# EAGLE design CS_NAV_SNS (EAGLE 9.4.2)
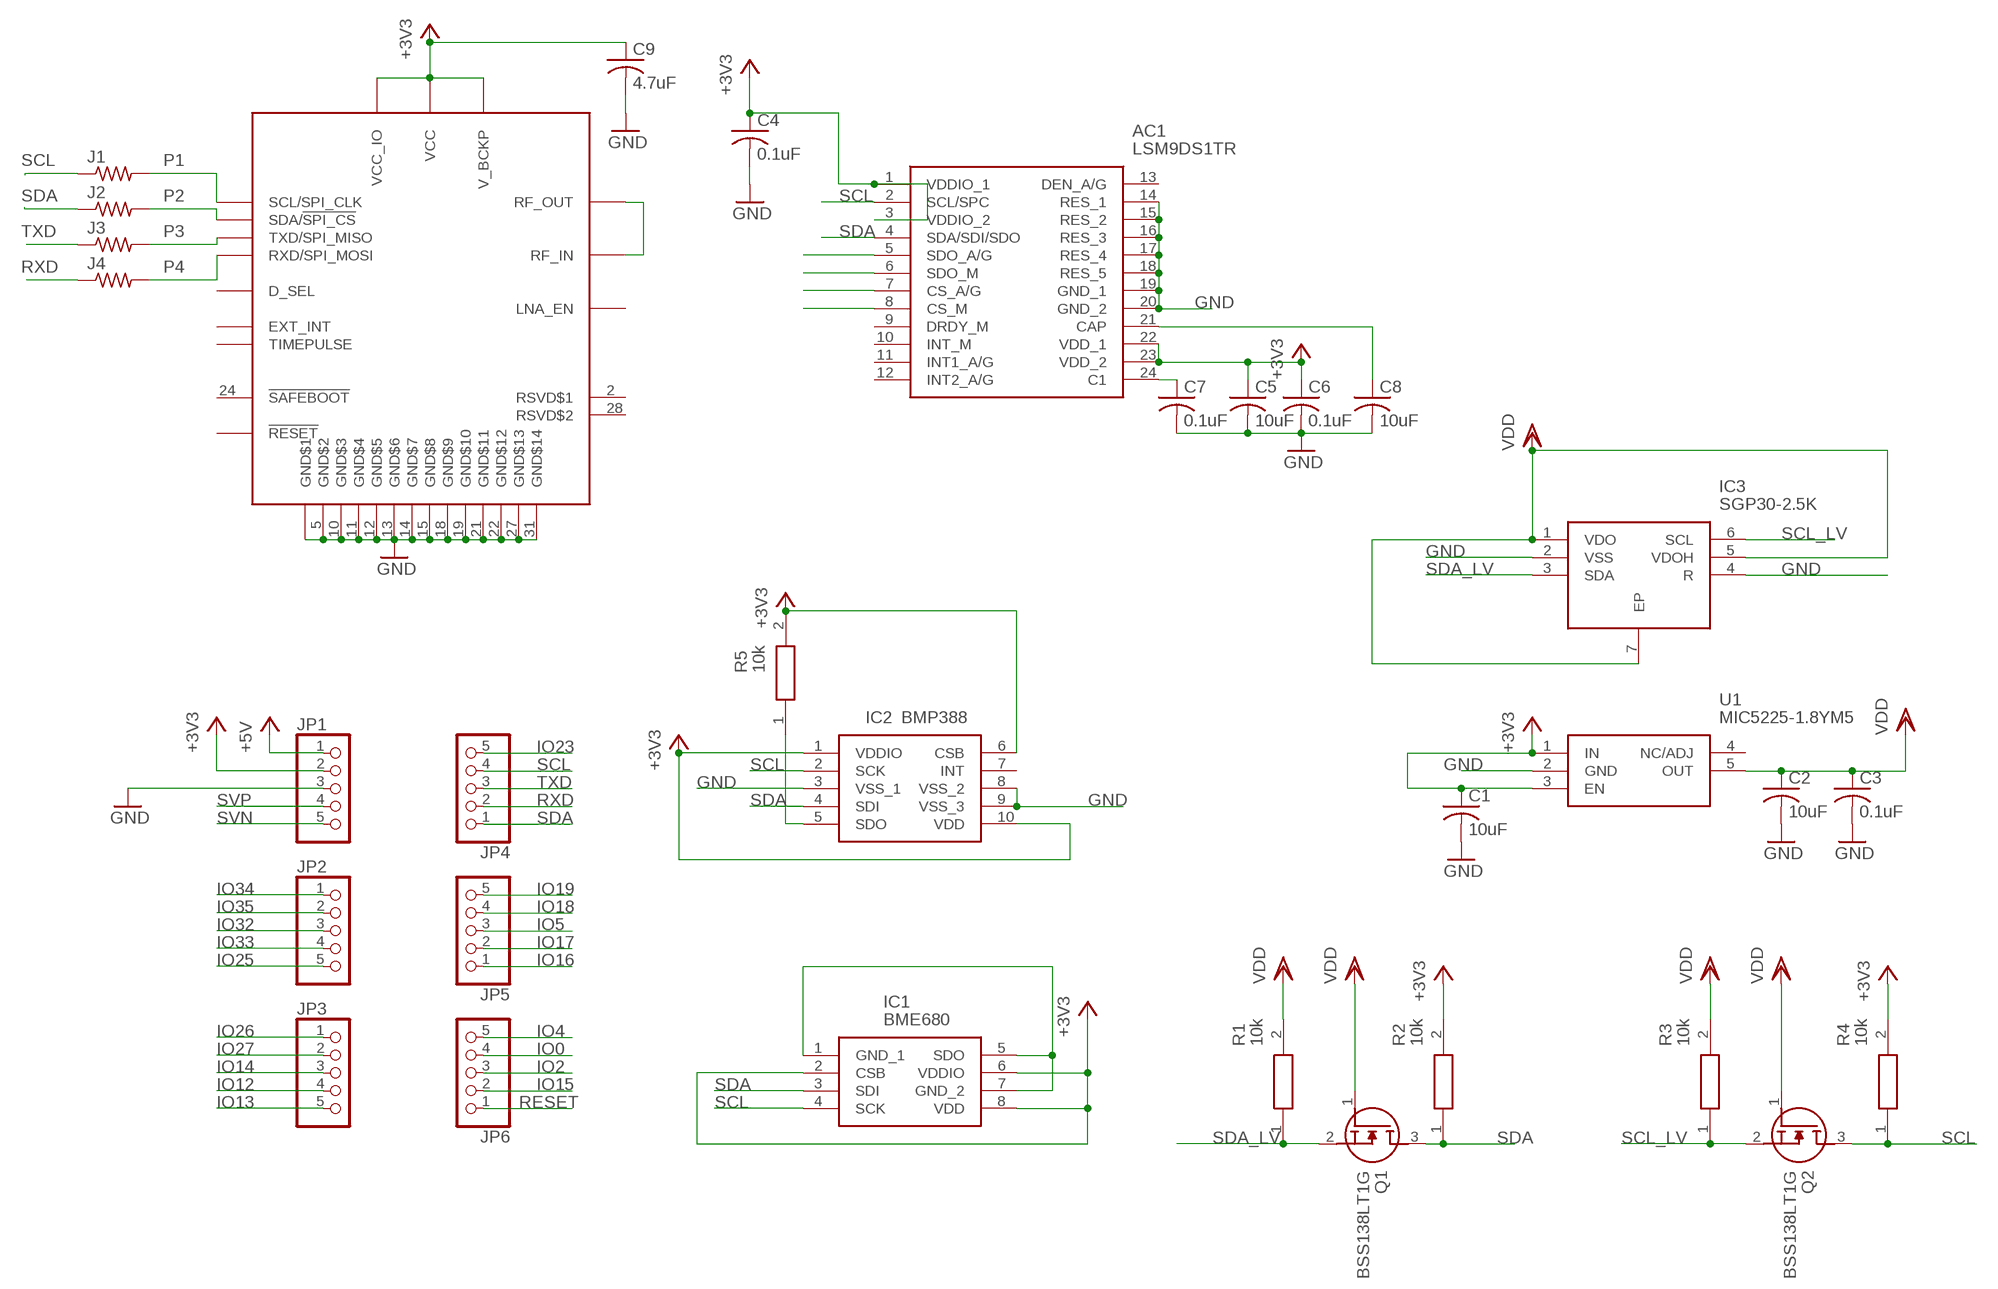
[diagram p0: schematic, sheet 1]

## Parts
AC1  LSM9DS1TR  [LGA-24L(3X3.5X1MM)]
C1  10uF  C-USC0805  [C0805]
C2  10uF  C-USC0805  [C0805]
C3  0.1uF  C-USC0805  [C0805]
C4  0.1uF  C-USC0805  [C0805]
C5  10uF  C-USC0805  [C0805]
C6  0.1uF  C-USC0805  [C0805]
C7  0.1uF  C-USC0805  [C0805]
C8  10uF  C-USC0805  [C0805]
C9  4.7uF  C-USC0805  [C0805]
IC1  BME680  [BME680]
IC2  BMP388  [BMP388]
IC3  SGP30-2.5K  [SON80P245X245X90-7N]
J1  R-US_R1206  [R1206]
J2  R-US_R1206  [R1206]
J3  R-US_R1206  [R1206]
J4  R-US_R1206  [R1206]
JP1  PINHD-1X5  [1X05]
JP2  PINHD-1X5  [1X05]
JP3  PINHD-1X5  [1X05]
JP4  PINHD-1X5  [1X05]
JP5  PINHD-1X5  [1X05]
JP6  PINHD-1X5  [1X05]
Q1  BSS138LT1G  [SOT96P237X111-3N]
Q2  BSS138LT1G  [SOT96P237X111-3N]
R1  10k  ERA-6AED134V  [RESC2012X60N]
R2  10k  ERA-6AED134V  [RESC2012X60N]
R3  10k  ERA-6AED134V  [RESC2012X60N]
R4  10k  ERA-6AED134V  [RESC2012X60N]
R5  10k  ERA-6AED134V  [RESC2012X60N]
U1  MIC5225-1.8YM5  [SOT95P280X145-5N]
U$1  CAM-M8  [CAM-M8]

## Nets
+3V3: AC1.1(VDDIO_1) AC1.3(VDDIO_2) AC1.22(VDD_1) AC1.23(VDD_2) C1.1 C4.1 C5.1 C6.1 C9.1 IC1.2(CSB) IC1.6(VDDIO) IC1.8(VDD) IC2.1(VDDIO) IC2.6(CSB) IC2.10(VDD) JP1.2 R2.2 R4.2 R5.2 U1.1(IN) U1.3(EN) U$1.1(VCC_IO) U$1.8(V_BCKP) U$1.9(VCC)
+5V: JP1.1
GND: AC1.14(RES_1) AC1.15(RES_2) AC1.16(RES_3) AC1.17(RES_4) AC1.18(RES_5) AC1.19(GND_1) AC1.20(GND_2) C1.2 C2.2 C3.2 C4.2 C5.2 C6.2 C7.2 C8.2 C9.2 IC2.3(VSS_1) IC2.8(VSS_2) IC2.9(VSS_3) IC3.2(VSS) IC3.4(R) JP1.3 U1.2(GND) U$1.4(GND$1) U$1.5(GND$2) U$1.10(GND$3) U$1.11(GND$4) U$1.12(GND$5) U$1.13(GND$6) U$1.14(GND$7) U$1.15(GND$8) U$1.18(GND$9) U$1.19(GND$10) U$1.21(GND$11) U$1.22(GND$12) U$1.27(GND$13) U$1.31(GND$14)
IO0: JP6.4
IO2: JP6.3
IO4: JP6.5
IO5: JP5.3
IO12: JP3.4
IO13: JP3.5
IO14: JP3.3
IO15: JP6.2
IO16: JP5.1
IO17: JP5.2
IO18: JP5.4
IO19: JP5.5
IO23: JP4.5
IO25: JP2.5
IO26: JP3.1
IO27: JP3.2
IO32: JP2.3
IO33: JP2.4
IO34: JP2.1
IO35: JP2.2
N$1: U$1.16(RF_OUT) U$1.17(RF_IN)
N$2: IC2.5(SDO) R5.1
N$3: IC1.1(GND_1) IC1.5(SDO) IC1.7(GND_2)
N$4: AC1.5(SDO_A/G)
N$5: AC1.6(SDO_M)
N$6: AC1.24(C1) C7.1
N$7: AC1.21(CAP) C8.1
N$8: AC1.7(CS_A/G)
N$9: AC1.8(CS_M)
P1: J1.2 U$1.6(SCL/SPI_CLK)
P2: J2.2 U$1.3(SDA/!SPI_CS)
P3: J3.2 U$1.25(TXD/SPI_MISO)
P4: J4.2 U$1.26(RXD/SPI_MOSI)
RESET: JP6.1
RXD: J4.1 JP4.2
SCL: AC1.2(SCL/SPC) IC1.4(SCK) IC2.2(SCK) J1.1 JP4.4 Q2.3(D) R4.1
SCL_LV: IC3.6(SCL) Q2.2(S) R3.1
SDA: AC1.4(SDA/SDI/SDO) IC1.3(SDI) IC2.4(SDI) J2.1 JP4.1 Q1.3(D) R2.1
SDA_LV: IC3.3(SDA) Q1.2(S) R1.1
SVN: JP1.5
SVP: JP1.4
TXD: J3.1 JP4.3
VDD: C2.1 C3.1 IC3.1(VDO) IC3.5(VDOH) IC3.7(EP) Q1.1(G) Q2.1(G) R1.2 R3.2 U1.5(OUT)
Unconnected: AC1.9(DRDY_M) AC1.10(INT_M) AC1.11(INT1_A/G) AC1.12(INT2_A/G) AC1.13(DEN_A/G) IC2.7(INT) U1.4(NC/ADJ) U$1.2(RSVD$1) U$1.7(EXT_INT) U$1.20(D_SEL) U$1.23(!RESET) U$1.24(!SAFEBOOT) U$1.28(RSVD$2) U$1.29(TIMEPULSE) U$1.30(LNA_EN)

## Library data of the parts
AC1 = SamacSys_Parts:LSM9DS1TR: iNEMO Inertial 3D Accel/Gyro/Magn. LGA24 STMicroelectronics LSM9DS1TR 3-Axis Accelerometer, Gyroscope & Magnetometer, 0 400 kHz, 1.9 3.6 V Source: Datasheet <http://www.st.com/content/ccc/resource/technical/document/datasheet/1e/3f/2a/d6/25/eb/48/46/DM00103319.pdf/files/DM00103319.pdf/jcr:content/translations/en.DM00103319.pdf>; DESCRIPTION: iNEMO Inertial 3D Accel/Gyro/Magn. LGA24 STMicroelectronics LSM9DS1TR 3-Axis Accelerometer, Gyroscope & Magnetometer, 0 400 kHz, 1.9 3.6 V; HEIGHT: mm; MANUFACTURER_NAME: STMicroelectronics; MANUFACTURER_PART_NUMBER: LSM9DS1TR; MOUSER_PART_NUMBER: 511-LSM9DS1TR; MOUSER_PRICE-STOCK: https://www.mouser.com/Search/Refine.aspx?Keyword=511-LSM9DS1TR; RS_PART_NUMBER: 1660908; RS_PRICE-STOCK: https://uk.rs-online.com/web/p/products/1660908
C1-C9 = rcl:C-US: CAPACITOR, American symbol; SPICEPREFIX: C
IC1 = SamacSys_3D:BME680: Air Quality Sensors Environmental Sensor VOC IIR EMC Source: Datasheet <https://ae-bst.resource.bosch.com/media/_tech/media/datasheets/BST-BME680-DS001.pdf>; DESCRIPTION: Air Quality Sensors Environmental Sensor VOC IIR EMC; HEIGHT: 1mm; MANUFACTURER_NAME: Bosch; MANUFACTURER_PART_NUMBER: BME680; MOUSER_PART_NUMBER: 262-BME680
IC2 = SamacSys_3D:BMP388: Board Mount Pressure Sensors MEMS Absolute Barometric Pressure Sensor Source: Datasheet <https://ae-bst.resource.bosch.com/media/_tech/media/datasheets/BST-BMP388-DS001-01.pdf>; DESCRIPTION: Board Mount Pressure Sensors MEMS Absolute Barometric Pressure Sensor; HEIGHT: 0mm; MANUFACTURER_NAME: Bosch Sensortec; MANUFACTURER_PART_NUMBER: BMP388; MOUSER_PART_NUMBER: 262-BMP388; MOUSER_PRICE-STOCK: https://www.mouser.com/Search/Refine.aspx?Keyword=262-BMP388
IC3 = SamacSys_3D:SGP30-2.5K: Air Quality Sensors Multi-Pixel SGP Gas Sensor Source: Datasheet <http://www.mouser.com/ds/2/682/Sensirion_Gas_Sensors_SGP30_Preliminary_Datasheet-1128067.pdf>; DESCRIPTION: Air Quality Sensors Multi-Pixel SGP Gas Sensor; HEIGHT: 0.9mm; MANUFACTURER_NAME: Sensirion; MANUFACTURER_PART_NUMBER: SGP30-2.5k; MOUSER_PART_NUMBER: 403-SGP30-2.5K; MOUSER_PRICE-STOCK: https://www.mouser.com/Search/Refine.aspx?Keyword=403-SGP30-2.5K; RS_PART_NUMBER: 1463573; RS_PRICE-STOCK: http://uk.rs-online.com/web/p/products/1463573
J1-J4 = resistor:R-US_: RESISTOR, American symbol
JP1-JP6 = pinhead:PINHD-1X5: PIN HEADER
Q1 Q2 = SamacSys_Parts:BSS138LT1G: MOSFET N-Channel 50V 0.2A SOT23 ON Semiconductor BSS138LT1G N-channel MOSFET Transistor, 0.2 A, 50 V, 3-Pin SOT-23 Source: Datasheet <http://www.onsemi.com/pub/Collateral/BSS138LT1-D.PDF>; ALLIED_NUMBER: 70099493; ALLIED_PRICE-STOCK: http://www.alliedelec.com/on-semiconductor-bss138lt1g/70099493/; DESCRIPTION: MOSFET N-Channel 50V 0.2A SOT23 ON Semiconductor BSS138LT1G N-channel MOSFET Transistor, 0.2 A, 50 V, 3-Pin SOT-23; HEIGHT: 1.11mm; MANUFACTURER_NAME: ON Semiconductor; MANUFACTURER_PART_NUMBER: BSS138LT1G; MOUSER_PART_NUMBER: 863-BSS138LT1G; MOUSER_PRICE-STOCK: https://www.mouser.com/Search/Refine.aspx?Keyword=863-BSS138LT1G; RS_PART_NUMBER: 5452529P; RS_PRICE-STOCK: http://uk.rs-online.com/web/p/products/5452529P
R1-R5 = SamacSys_Parts:ERA-6AED134V: PANASONIC ELECTRONIC COMPONENTS - ERA-6AED134V - RES, THIN FILM, 130K, 0.5%, 0.125W, 0805 Source: Datasheet <https://industrial.panasonic.com/cdbs/www-data/pdf/RDA0000/AOA0000C237.pdf>; DESCRIPTION: PANASONIC ELECTRONIC COMPONENTS - ERA-6AED134V - RES, THIN FILM, 130K, 0.5%, 0.125W, 0805; HEIGHT: 0.6mm; MANUFACTURER_NAME: Panasonic; MANUFACTURER_PART_NUMBER: ERA-6AED134V; MOUSER_PART_NUMBER: 667-ERA-6AED134V; MOUSER_PRICE-STOCK: https://www.mouser.com/Search/Refine.aspx?Keyword=667-ERA-6AED134V
U1 = SamacSys_Parts:MIC5225-1.8YM5: Ultra-Low Quiescent Current 150mA uCap Low Dropout Regulator Source: Datasheet <http://www.mouser.com/ds/2/268/mic5225-1082288.pdf>; DESCRIPTION: Ultra-Low Quiescent Current 150mA uCap Low Dropout Regulator; HEIGHT: 1.45mm; MANUFACTURER_NAME: Micrel; MANUFACTURER_PART_NUMBER: MIC5225-1.8YM5
U$1 = ubloxLib:CAM-M8: CAM-M8x: M8 Concurrent GNSS Antenna Module u-blox.com

## Board
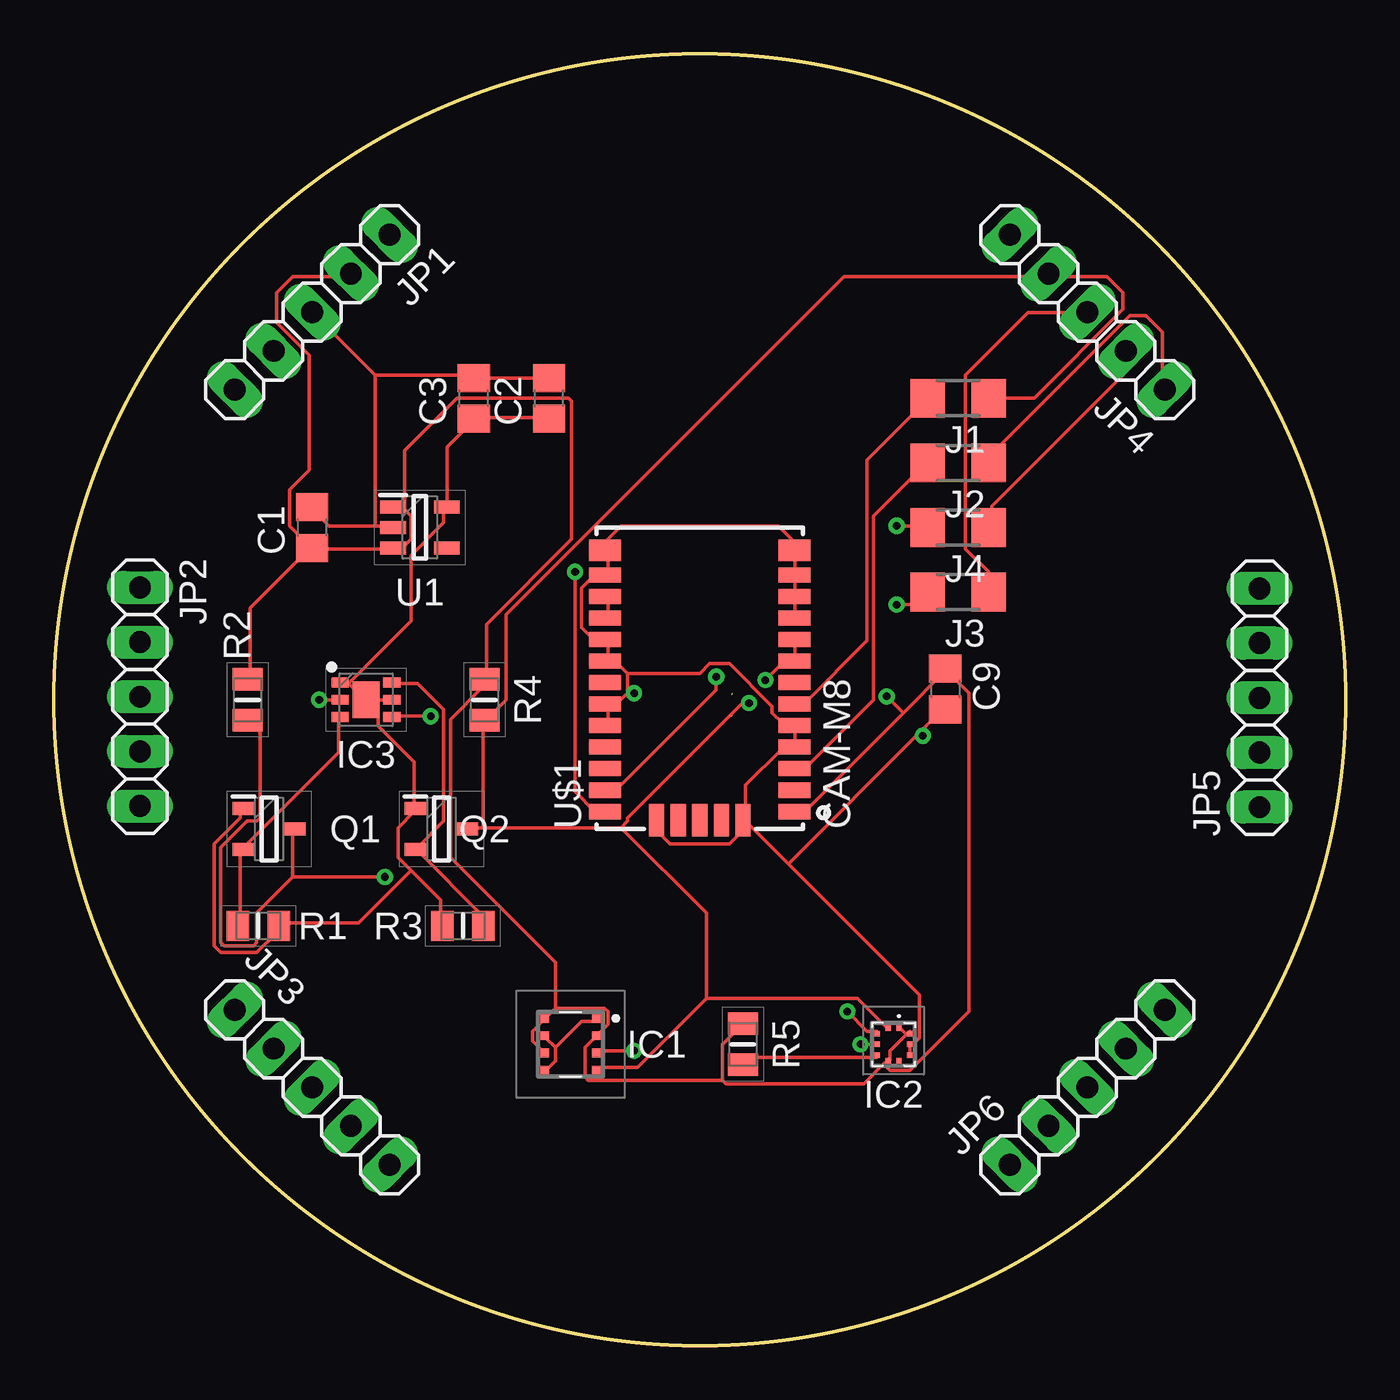
[diagram p1: board, top side]
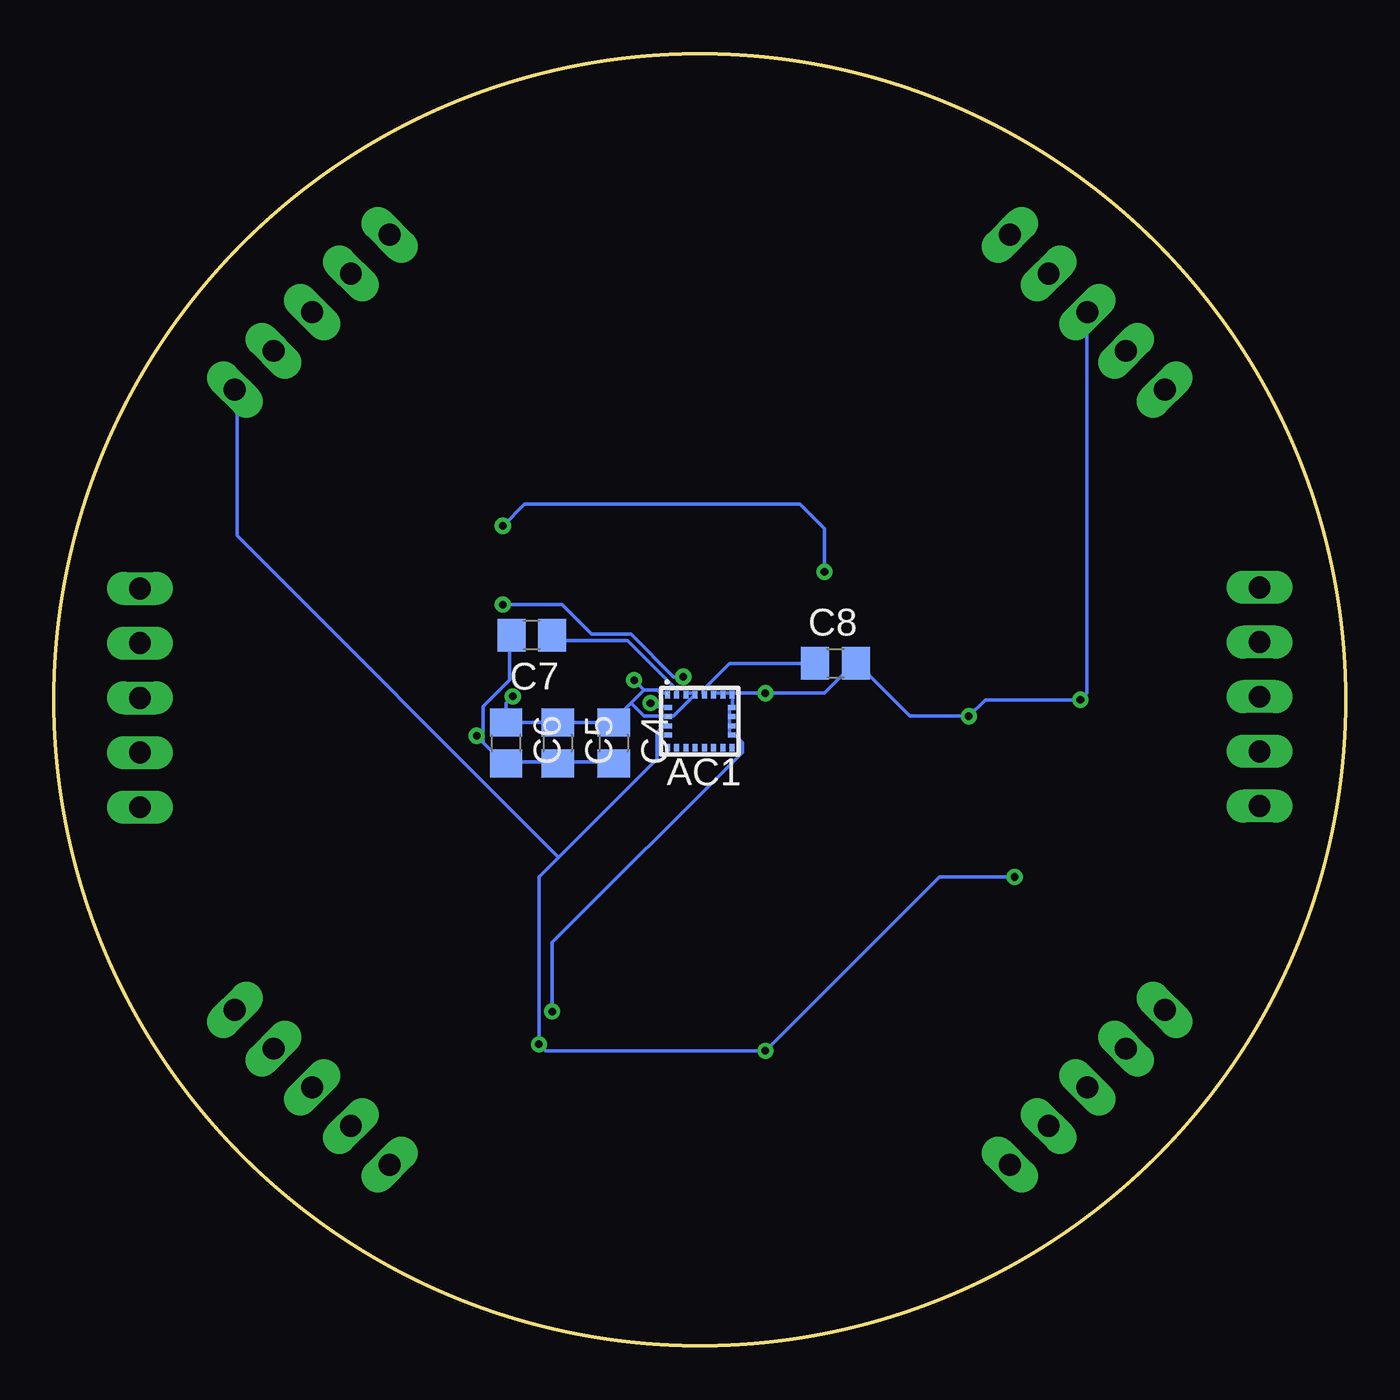
[diagram p2: board, bottom side, seen from below]

Size 60 x 60 mm. Coordinates in mm from the lower left corner, seen from the top.
Outline: circle at 30,30 radius 30
Copper layers (1*16): Top 0.035mm / dielectric 1.5mm / Bottom 0.035mm
Design rules "default": minimum track width 6mil, minimum drill 0.35mm, track to track 6mil, track to pad 6mil, pad to pad 6mil, via to via 6mil, smd to smd 6mil, copper to edge 40mil, drill to drill 6mil, minimum pad ring 10mil, minimum via ring 8mil, stop-mask expansion 4mil, vias tented up to drill 0mil, thermal gap 10mil

### Footprints (pad centres in the part's own frame; a part is rotated, then mirrored left to right if it is on the bottom)
LGA-24L(3X3.5X1MM) = smd 0.23 x 0.35: 1 -1.505,1.225; 6 -1.505,-1.225; 7 -1.075,-1.225; 8 -0.645,-1.225; 9 -0.215,-1.225; 10 0.215,-1.225; 11 0.645,-1.225; 12 1.075,-1.225; 13 1.505,-1.225; 18 1.505,1.225; 19 1.075,1.225; 20 0.645,1.225; 21 0.215,1.225; 22 -0.215,1.225; 23 -0.645,1.225; 24 -1.075,1.225 | smd 0.35 x 0.23: 2 -1.475,0.645; 3 -1.475,0.215; 4 -1.475,-0.215; 5 -1.475,-0.645; 14 1.475,-0.645; 15 1.475,-0.215; 16 1.475,0.215; 17 1.475,0.645
C0805 = smd 1.3 x 1.5: 1 -0.95,0; 2 0.95,0
BME680 = smd 0.4 x 0.4: 1 1.2,1.2; 2 1.2,0.4; 3 1.2,-0.4; 4 1.2,-1.2; 5 -1.2,-1.2; 6 -1.2,-0.4; 7 -1.2,0.4; 8 -1.2,1.2
BMP388 = smd 0.25 x 0.275: 1 0.25,0.763; 2 -0.25,0.763; 6 -0.25,-0.763; 7 0.25,-0.763 | smd 0.275 x 0.25: 3 -0.762,0.5; 4 -0.762,0; 5 -0.762,-0.5; 8 0.762,-0.5; 9 0.762,0; 10 0.762,0.5
SON80P245X245X90-7N = smd 0.8 x 0.45: 1 -1.2,0.8; 2 -1.2,0; 3 -1.2,-0.8; 4 1.2,-0.8; 5 1.2,0; 6 1.2,0.8 | smd 1.25 x 1.7: 7 0,0
R1206 = smd 1.6 x 1.803: 1 -1.422,0; 2 1.422,0
1X05 = drill 1.016 long: 1 -5.08,0; 2 -2.54,0; 3 0,0; 4 2.54,0; 5 5.08,0
SOT96P237X111-3N = smd 1 x 0.6: 1 -1.2,0.955; 2 -1.2,-0.955; 3 1.2,0
RESC2012X60N = smd 1.05 x 1.4: 1 -0.95,0; 2 0.95,0
SOT95P280X145-5N = smd 1.2 x 0.6: 1 -1.25,0.95; 2 -1.25,0; 3 -1.25,-0.95; 4 1.25,-0.95; 5 1.25,0.95
CAM-M8 = smd 0.7 x 1.5: 1 -6.2,-4.4; 2 -5.2,-4.4; 3 -4.2,-4.4; 4 -3.2,-4.4; 5 -2.2,-4.4; 6 -1.2,-4.4; 7 -0.2,-4.4; 8 0.8,-4.4; 9 1.8,-4.4; 10 2.8,-4.4; 11 3.8,-4.4; 12 4.8,-4.4; 15 4.8,4.4; 16 3.8,4.4; 17 2.8,4.4; 18 1.8,4.4; 19 0.8,4.4; 20 -0.2,4.4; 21 -1.2,4.4; 22 -2.2,4.4; 23 -3.2,4.4; 24 -4.2,4.4; 25 -5.2,4.4; 26 -6.2,4.4 | smd 1 x 1.5: 13 5.95,-4.4; 14 5.95,4.4 | smd 1.5 x 0.7: 27 -6.6,2; 28 -6.6,1; 29 -6.6,0; 30 -6.6,-1; 31 -6.6,-2

### Placement (x,y rotation side)
AC1  30,29 0 bottom
C1  12,38 90 top
C2  23,44 90 top
C3  19.5,44 90 top
C4  34,28 270 bottom
C5  36.6,28 270 bottom
C6  39,28 270 bottom
C7  37.8,33 180 bottom
C8  23.7,31.7 0 bottom
C9  41.4,30.5 270 top
IC1  24,14 0 top
IC2  39,14 0 top
IC3  14.5,30 0 top
J1  42,44 180 top
J2  42,41 180 top
J3  42,35 180 top
J4  42,38 180 top
JP1  12,48 225 top
JP2  4,30.14 270 top
JP3  12,12 315 top
JP4  48,48 135 top
JP5  56,30.09 90 top
JP6  48,12 45 top
Q1  10,24 0 top
Q2  18,24 0 top
R1  9.5,19.5 0 top
R2  9,30 90 top
R3  19,19.5 180 top
R4  20,30 90 top
R5  32,14 90 top
U1  17,38 0 top
U$1  30,31 90 top

### Tracks (layer width: path | path; a pad name or v marks a point on that pad's centre or on a via)
+3V3  (via drill 0.35)  (3 unrouted)
  Top 0.152: 16.28,38.84 16.59,38.53 16.59,37.47 16.28,37.16 15.83,37.16 U1.3 15.67,37.01 12.02,37.01 C1.1 | 16.28,38.84 15.83,38.84 U1.1 16.28,38.84 | R2.2 9.12,31.07 9.12,34.27 11.86,37.01 C1.1 | JP1.2 13.69,49.66 11.1,49.66 10.34,48.9 10.34,47.53 11.86,46 11.86,40.67 10.95,39.75 10.95,38.08 11.86,37.16 C1.1 | U$1.9 34.42,32.74 34.42,31.83 U$1.8 34.27,31.68 33.81,31.68 v33.05,30.91 | 41.43,31.37 39.45,29.39 | 39.45,29.39 34.88,24.82 34.42,24.82 U$1.1 | 39.45,29.39 v38.69,30.15 | 39.6,14.46 39.75,14.61 IC2.10 | 39.6,14.46 38.84,13.69 38.84,13.24 IC2.6 38.69,13.24 38.53,13.08 | 39.6,14.46 39.3,14.76 IC2.1 | 38.53,13.08 37.62,12.17 31.22,12.17 31.07,12.32 | 31.07,12.32 31.07,14 31.98,14.91 R5.2 | IC1.6 22.68,13.69 22.23,14.15 22.23,14.61 22.68,15.06 IC1.8 22.84,15.22 23.29,15.67 | 23.29,15.67 25.58,15.67 25.73,15.52 25.73,14.91 25.28,14.46 IC1.2 25.12,14.3 24.67,13.85 24.67,12.47 24.82,12.32 31.07,12.32 | 23.29,15.67 23.29,17.81 18.42,22.68 18.42,29.09 19.94,30.61 19.94,30.91 R4.2 20.09,31.07 20.09,33.51 24.06,37.47 24.06,43.87 23.9,44.02 18.72,44.02 16.28,41.58 16.28,38.84 | 41.43,31.37 42.5,30.3 42.5,15.52 39.75,12.78 38.84,12.78 38.53,13.08 | 41.43,31.37 C9.1
  Bottom 0.152: AC1.23 30.61,30.3 30.3,30.3 AC1.22 30.3,30.15 31.22,29.24 31.37,29.24 | 31.52,30.3 31.83,30.3 31.98,30.46 32.59,30.46 | 33.2,29.85 33.96,29.09 C4.1 34.12,28.93 36.55,28.93 C5.1 36.71,28.93 38.99,28.93 C6.1 38.99,29.09 38.99,29.85 v38.69,30.15 | 33.2,29.85 32.59,30.46 | 31.52,29.24 32.59,29.24 33.2,29.85 | 32.59,30.46 v33.05,30.91
GND  (via drill 0.35)
  Top 0.152: U$1.10 34.42,33.81 34.42,34.72 U$1.11 34.42,34.88 34.42,35.79 U$1.12 34.42,35.94 34.42,36.86 U$1.13 34.27,37.01 34.27,37.47 33.66,38.08 26.34,38.08 25.73,37.47 25.73,37.01 U$1.14 25.73,36.86 25.73,35.94 U$1.15 25.58,35.79 25.12,35.79 24.51,35.18 24.51,33.35 24.97,32.9 25.58,32.9 U$1.18 25.73,32.74 25.73,31.83 U$1.19 25.73,31.68 26.19,31.68 26.65,31.22 | U$1.22 25.73,28.93 25.73,29.7 U$1.21 25.73,29.85 26.19,29.85 26.65,30.3 | 26.65,31.22 26.65,30.3 | IC2.9 39.75,13.54 IC2.8 | IC2.9 39.91,14 40.21,14.3 40.21,16.28 34.12,22.38 | 32.29,24.21 32.13,24.36 U$1.31 | 32.29,24.21 34.12,22.38 | IC2.9 | 32.29,24.21 31.37,23.29 28.63,23.29 28.02,23.9 28.02,24.36 U$1.27 | 32.29,24.21 U$1.31 | 34.12,22.38 40.21,28.48 | 40.21,28.48 41.28,29.54 C9.2 | U$1.31 32.13,24.51 32.13,26.04 33.81,27.71 34.27,27.71 U$1.4 34.42,27.87 34.42,28.78 U$1.5 34.27,28.93 33.81,28.93 33.35,29.39 33.35,29.7 31.37,31.68 30.46,31.68 30,31.22 26.65,31.22 | 40.21,28.48 v40.36,28.32 | 14.91,38.08 12.78,38.08 12.02,38.84 C1.2 | 14.91,38.08 15.67,38.08 U1.2 | C2.2 22.99,44.94 19.64,44.94 C3.2 19.48,45.09 14.91,45.09 | JP1.3 14.91,45.09 | 14.91,45.09 14.91,38.08 | v17.5,29.24 15.83,29.24 IC3.4 | v12.32,30 IC3.2 | v36.86,15.52 37.77,14.61 38.23,14.61 IC2.3 | v26.95,30.3 26.65,30.3
  Bottom 0.152: C4.2 34.12,27.1 36.55,27.1 C5.2 36.71,27.1 38.99,27.1 C6.2 39.14,27.1 40.06,28.02 40.06,28.32 | 40.06,28.32 40.06,29.7 38.84,30.91 38.84,32.9 C7.2 | v40.36,28.32 40.06,28.32 | 28.63,29.24 28.63,28.78 | 28.63,29.24 28.63,29.54 AC1.17 28.48,29.7 28.48,30.15 AC1.18 28.48,30.3 | 28.63,29.24 AC1.16 | 28.93,30.3 28.48,30.3 | 28.93,30.3 29.39,30.3 AC1.20 | 28.93,30.3 AC1.19 | v36.86,15.52 36.86,18.72 28.02,27.56 28.02,28.02 28.32,28.32 28.48,28.32 AC1.14 28.63,28.32 28.63,28.78 | 28.63,28.78 AC1.15 | 28.48,30.3 v26.95,30.3 24.21,30.3 22.84,31.68 C8.2 22.68,31.68 20.25,29.24 v17.5,29.24 16.74,30 v12.32,30 12.02,30.3 12.02,47.98 JP1.3
N$1
  Top 0.152: U$1.17 25.73,33.81 25.73,34.72 U$1.16
N$2
  Top 0.152: IC2.5 38.23,13.39 32.44,13.39 32.13,13.08 R5.1
N$3
  Top 0.152: 23.29,13.85 23.29,13.24 22.99,12.93 22.84,12.93 IC1.5 | 23.29,13.85 22.84,14.3 IC1.7 | 23.29,13.85 24.51,15.06 25.12,15.06 IC1.1
N$6
  Bottom 0.152: AC1.24 31.07,30.3 31.07,30.46 33.35,32.74 36.55,32.74 36.71,32.9 C7.1
N$7
  Bottom 0.152: AC1.21 29.85,30.3 29.85,30.46 28.63,31.68 24.67,31.68 C8.1
P1
  Top 0.152: U$1.6 34.42,29.85 34.88,29.85 37.77,32.74 37.77,41.12 40.52,43.87 J1.2
P2
  Top 0.152: U$1.3 34.42,26.95 35.03,26.95 38.08,30 38.08,38.53 40.52,40.97 J2.2
P3  (via drill 0.35)
  Top 0.152: v30.76,31.07 30.76,30.46 26.19,25.88 25.73,25.88 U$1.25 | v39.14,34.42 40.06,34.42 40.52,34.88 J3.2
  Bottom 0.152: v30.76,31.07 31.22,31.07 33.2,33.05 35.03,33.05 36.4,34.42 v39.14,34.42
P4  (via drill 0.35)
  Top 0.152: v24.21,35.94 24.21,25.73 25.12,24.82 25.58,24.82 U$1.26 | v39.14,38.08 40.52,38.08 J4.2
  Bottom 0.152: v24.21,35.94 24.21,37.94 25.34,39.08 38.14,39.08 v39.14,38.08
RXD
  Top 0.152: J4.1 43.56,38.08 43.56,38.99 49.66,45.09 49.66,46.15 JP4.2
SCL  (via drill 0.35)
  Top 0.152: 30.3,16.13 37.31,16.13 38.69,14.76 IC2.2 | 30.3,16.13 27.1,12.93 25.28,12.93 IC1.4 | J1.1 43.56,44.02 45.55,44.02 49.66,48.14 49.66,48.9 48.9,49.66 46.31,49.66 JP4.4 46.15,49.66 36.71,49.66 21.01,33.96 21.01,30 20.09,29.09 R4.1 19.94,28.93 19.94,24.06 | v32.29,29.85 31.98,29.85 26.65,24.51 26.65,24.36 26.34,24.06 | 19.94,24.06 19.33,24.06 Q2.3 | 19.94,24.06 26.34,24.06 | 30.3,16.13 30.3,20.09 26.34,24.06
  Bottom 0.152: v32.29,29.85 32.13,29.7 31.52,29.7 AC1.2
SCL_LV
  Top 0.152: IC3.6 15.83,30.76 16.89,30.76 18.11,29.54 18.11,24.36 16.89,23.14 Q2.2 16.89,22.99 19.94,19.94 19.94,19.64 R3.1
SDA  (via drill 0.35)
  Top 0.152: J2.1 43.56,41.12 43.56,41.43 49.96,47.83 50.73,47.83 51.49,47.07 51.49,44.48 JP4.1 | 11.1,21.77 11.1,23.9 Q1.3 | 11.1,21.77 9.43,20.09 9.43,18.72 9.27,18.57 7.9,18.57 7.75,18.72 7.75,23.14 8.97,24.36 9.43,24.36 9.58,24.51 9.58,28.48 9.12,28.93 R2.1 | v37.47,14 IC2.4 | v26.95,13.69 25.28,13.69 IC1.3 | v15.37,21.77 11.1,21.77
  Bottom 0.152: 36.55,22.68 31.98,27.26 31.98,28.48 31.68,28.78 31.52,28.78 AC1.4 | 36.55,22.68 37.47,21.77 v37.47,14 37.16,13.69 v26.95,13.69 18.88,21.77 v15.37,21.77 | 36.55,22.68 51.49,37.62 51.49,44.33 JP4.1
SDA_LV
  Top 0.152: IC3.3 13.24,29.09 13.24,27.56 8.82,23.14 Q1.2 8.66,22.99 8.66,19.64 R1.1
TXD
  Top 0.152: J3.1 43.41,35.03 43.41,35.94 42.34,37.01 42.34,45.09 45.24,47.98 47.98,47.98 JP4.3
VDD
  Top 0.152: C2.1 22.99,43.11 19.64,43.11 C3.1 19.48,42.95 18.27,41.73 18.27,38.99 U1.5 18.11,38.84 18.11,38.23 16.59,36.71 16.59,33.66 13.69,30.76 | Q1.1 8.66,24.82 8.66,24.51 7.45,23.29 7.45,18.57 7.75,18.27 9.43,18.27 10.34,19.18 10.34,19.48 R1.2 10.49,19.64 14.15,19.64 16.59,22.07 | 15.06,30 IC3.7 14.46,30 13.69,30.76 | 15.06,30 IC3.5 | 13.69,30.76 13.39,30.76 IC3.1 13.69,30.76 | 15.06,30 15.06,28.78 16.74,27.1 16.74,24.97 Q2.1 16.74,24.82 15.98,24.06 15.98,22.68 16.59,22.07 | 16.59,22.07 17.96,20.7 17.96,19.64 R3.2